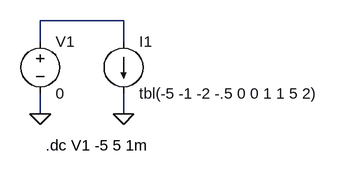
[diagram p0: schematic table.asc]
table.asc, the LTspice schematic file:
Version 4
SHEET 1 880 680
WIRE -32 176 -160 176
WIRE -160 208 -160 176
WIRE -32 208 -32 176
WIRE -160 320 -160 288
WIRE -32 320 -32 288
FLAG -160 320 0
FLAG -32 320 0
SYMBOL current -32 208 R0
SYMATTR InstName I1
SYMATTR Value tbl(-5 -1 -2 -.5 0 0 1 1 5 2)
SYMBOL voltage -160 192 R0
SYMATTR InstName V1
SYMATTR Value 0
TEXT -152 368 Left 2 !.dc V1 -5 5 1m

The netlist it stands for:
* table.asc
I1 N001 0 tbl(-5 -1 -2 -.5 0 0 1 1 5 2)
V1 N001 0 0
.dc V1 -5 5 1m
.backanno
.end